# Altium schematic sheet IGBT_half_bridge.SchDoc
size A4
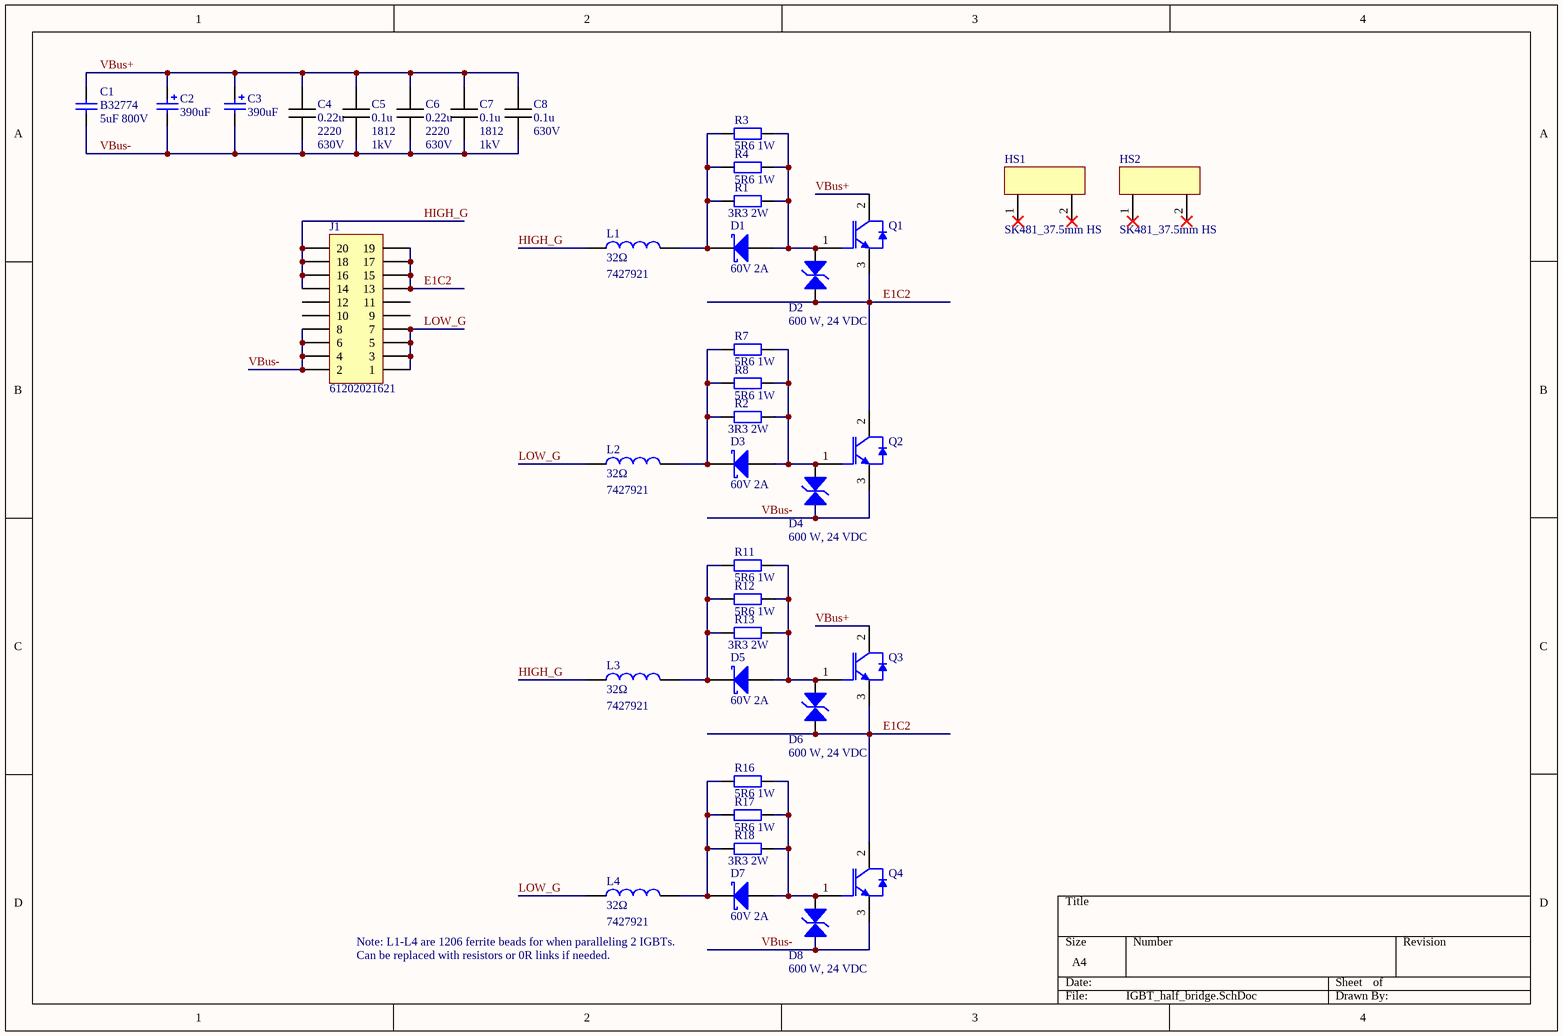
[diagram p0: IGBT_half_bridge.SchDoc]

## Parts
C1  B32774  value 5uF 800V  [B32774 5uF 800V]
C2  390uF  [WCAP-AIG8_30x46]
C3  390uF  [WCAP-AIG8_30x46]
C4  Capacitance: 0.22u  package: 2220  voltage: 630V  [2220C]  (hidden comment: Capacitor)
C5  Capacitance: 0.1u  package: 1812  voltage: 1kV  [1812C]  (hidden comment: Capacitor)
C6  Capacitance: 0.22u  package: 2220  voltage: 630V  [2220C]  (hidden comment: Capacitor)
C7  Capacitance: 0.1u  package: 1812  voltage: 1kV  [1812C]  (hidden comment: Capacitor)
C8  Capacitance: 0.1u  voltage: 630V  [Cap_multi_footprint]  (hidden comment: Capacitor)
D1  60V 2A  [DO-214AA_(SMB-J-BEND)_UNI]
D2  600 W, 24 VDC  [DO-214AA_Bidirectional]
D3  60V 2A  [DO-214AA_(SMB-J-BEND)_UNI]
D4  600 W, 24 VDC  [DO-214AA_Bidirectional]
D5  60V 2A  [DO-214AA_(SMB-J-BEND)_UNI]
D6  600 W, 24 VDC  [DO-214AA_Bidirectional]
D7  60V 2A  [DO-214AA_(SMB-J-BEND)_UNI]
D8  600 W, 24 VDC  [DO-214AA_Bidirectional]
HS1  SK481_37.5mm HS  [SK 481 37.5]
HS2  SK481_37.5mm HS  [SK 481 37.5_FLIP]
J1  61202021621  [61202021621]
L1  32Ω  PartNumber: 7427921  [WE-CBF_1206_High Speed]
L2  32Ω  PartNumber: 7427921  [WE-CBF_1206_High Speed]
L3  32Ω  PartNumber: 7427921  [WE-CBF_1206_High Speed]
L4  32Ω  PartNumber: 7427921  [WE-CBF_1206_High Speed]
Q1  (no value)  [TO-247]
Q2  (no value)  [TO-247]
Q3  (no value)  [TO-247]
Q4  (no value)  [TO-247]
R1  value 3R3 2W  [Res_Radial_2W]
R2  value 3R3 2W  [Res_Radial_2W]
R3  value 5R6 1W  [RES_2512]  (hidden comment: Res2)
R4  value 5R6 1W  [RES_2512]  (hidden comment: Res2)
R7  value 5R6 1W  [RES_2512]  (hidden comment: Res2)
R8  value 5R6 1W  [RES_2512]  (hidden comment: Res2)
R11  value 5R6 1W  [RES_2512]  (hidden comment: Res2)
R12  value 5R6 1W  [RES_2512]  (hidden comment: Res2)
R13  value 3R3 2W  [Res_Radial_2W]
R16  value 5R6 1W  [RES_2512]  (hidden comment: Res2)
R17  value 5R6 1W  [RES_2512]  (hidden comment: Res2)
R18  value 3R3 2W  [Res_Radial_2W]

## Nets
E1C2: D2.2 D6.2 J1.13 J1.15 J1.17 J1.19 Q1.3(E) Q2.2(C) Q3.3(E) Q4.2(C)
HIGH_G: J1.14 J1.16 J1.18 J1.20 L1.1 L3.1
LOW_G: J1.1 J1.3 J1.5 J1.7 L2.1 L4.1
VBus+: C1.1 C2.1 C3.1 C4.1 C5.1 C6.1 C7.1 C8.2 Q1.2(C) Q3.2(C)
VBus-: C1.2 C2.2 C3.2 C4.2 C5.2 C6.2 C7.2 C8.1 D4.2 D8.2 J1.2 J1.4 J1.6 J1.8 Q2.3(E) Q4.3(E)
NetD1_A: D1.A D2.1 Q1.1(G) R1.2 R3.2 R4.2
NetD1_K: D1.K L1.2 R1.1 R3.1 R4.1
NetD3_A: D3.A D4.1 Q2.1(G) R2.2 R7.2 R8.2
NetD3_K: D3.K L2.2 R2.1 R7.1 R8.1
NetD5_A: D5.A D6.1 Q3.1(G) R11.2 R12.2 R13.2
NetD5_K: D5.K L3.2 R11.1 R12.1 R13.1
NetD7_A: D7.A D8.1 Q4.1(G) R16.2 R17.2 R18.2
NetD7_K: D7.K L4.2 R16.1 R17.1 R18.1

Not connected (* = marked no-connect by the designer): HS1 1* 2*; HS2 1* 2*; J1 9 10 11 12

## Notes on the sheet
- Note: L1-L4 are 1206 ferrite beads for when paralleling 2 IGBTs.
- Can be replaced with resistors or 0R links if needed.

## Library data of the parts
C1 = Cap: Capacitor; Published: 8-Jun-2000; LatestRevisionDate: 17-Jul-2002; LatestRevisionNote: Re-released for DXP Platform.; PackageReference: RAD-0.3; Publisher: Altium Limited; PackageDescription: Radial Cap, Thru-Hole; 2 Leads; 0.3 in Pin Spacing
C2 C3 = WCAP-AIG8, 861011485019: WCAP-AIG8 Aluminum Electrolytic Capacitors, 390uF; RatedVoltage: 450V; PublishedDate: July 2016; Publisher: Wurth Elektronik; ComponentLink1Description: Manufacturer; ComponentLink1URL: http://www.we-online.de; ComponentLink2Description: Datasheet; ComponentLink2URL: http://katalog.we-online.de/pbs/datasheet/861011485019.pdf; PartNumber: 861011485019; Value: 390uF; Size: 30mmx46mm
D1 D3 D5 D7 = SS26: SS26 Schottky rectifier
D2 D4 D6 D8 = WE-TVSP DO-214AA, 824521241: WE-TVSP Power TVS Diode, bidirectional, 600 W, 24 VDC; Manufacturer: Wurth Elektronik; partNo: 824521241; ComponentLink1Description: Manufacturer; ComponentLink1URL: http://www.we-online.de; Created by: Baojun Chen; Created Date: Nov.2015; ComponentLink2Description: Datasheet; ComponentLink2URL: http://katalog.we-online.de/pbs/datasheet/824521241.pdf
HS1 HS2 = SK_481_37.5
J1 = 61202021621: WR-BHD 2.54mm Male Box Header; Manufacturer: Wurth Elektronik; ComponentLink1 Description: Manufacturer; ComponentLink2 Description: Datasheet; NoPins: 20; Created Date: March 2016; partNo: 61202021621; ComponentLink1URL: http://www.we-online.com; ComponentLink2URL: http://katalog.we-online.de/em/datasheet/6120xx21621.pdf; Created by: Baojun Chen
L1-L4 = WE-CBF, 7427921: WE-CBF SMD EMI Suppression Ferrite Bead, 1206, 32Ω; Type: High Speed; PublishedDate: Aug 2016; Publisher: Wurth Elektronik; ComponentLink1Description: Manufacturer; ComponentLink1URL: http://www.we-online.de; ComponentLink2Description: Datasheet; ComponentLink2URL: http://katalog.we-online.de/pbs/datasheet/7427921.pdf; Value: 32Ω; Size: 1206
Q1-Q4 = TO-247_IGBT_V: IGBT, TO-247, Vertical
R1-R4 R7 R8 R11-R13 R16-R18 = Res2: Resistor; Published: 8-Jun-2000; LatestRevisionDate: 17-Jul-2002; LatestRevisionNote: Re-released for DXP Platform.; PackageReference: AXIAL-0.4; Publisher: Altium Limited; PackageDescription: Axial Device, Thru-Hole; 2 Leads; 0.4 in Pin Spacing
C4-C8 = Capacitor: tolerance: *; type: *; material: *